# Altium schematic sheet 407-cpu .schdoc
size A4
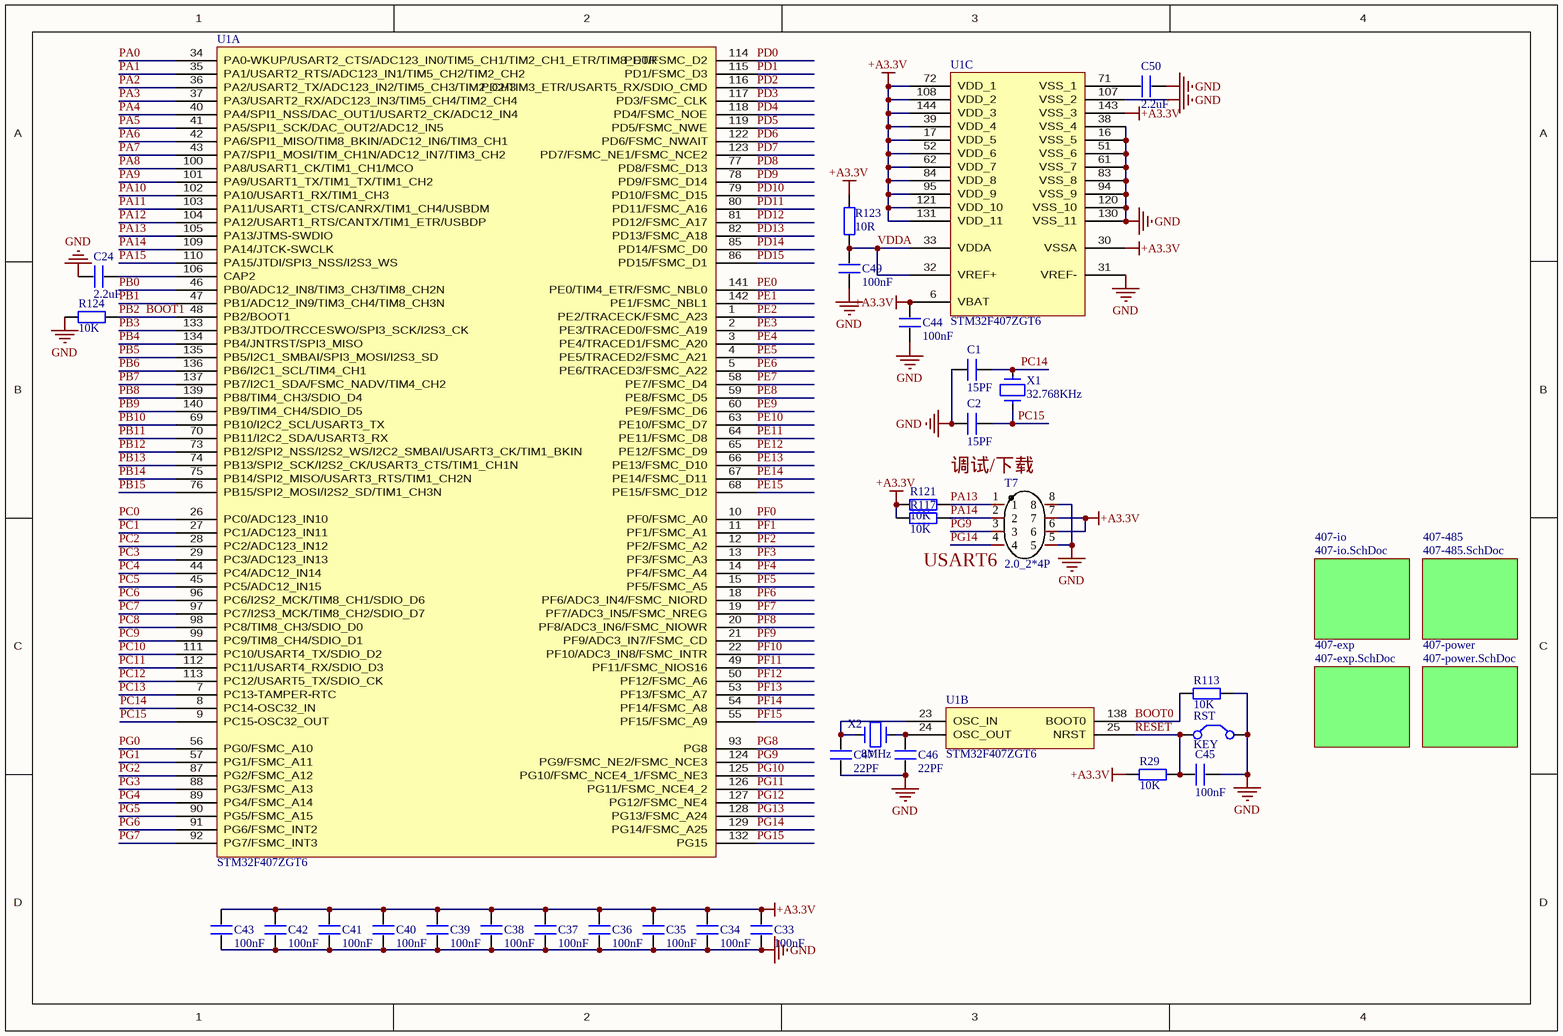
[diagram p0: 407-cpu .schdoc]

## Parts
C1  15PF
C2  15PF
C24  2.2uF
C33  100nF
C34  100nF
C35  100nF
C36  100nF
C37  100nF
C38  100nF
C39  100nF
C40  100nF
C41  100nF
C42  100nF
C43  100nF
C44  100nF
C45  100nF
C46  22PF
C47  22PF
C49  100nF
C50  2.2uF
R29  10K
R113  10K
R117  10K
R121  10K
R123  10R
R124  10K
RST  KEY
T7  2.0_2*4P  [2.0_2*4P]
U1  STM32F407ZGT6  (parts A,B,C of 3)
X1  32.768KHz
X2  8MHz

## Sub-sheets
407-485 = 407-485.SchDoc: no entries
407-exp = 407-exp.SchDoc: no entries
407-io = 407-io.SchDoc: no entries
407-power = 407-power.SchDoc: no entries

## Nets
+A3.3V: C33.2 C34.2 C35.2 C36.2 C37.2 C38.2 C39.2 C40.2 C41.2 C42.2 C43.2 C44.2 R29.1 R117.2 R121.2 R123.1 T7.6 T7.7 U1.6(VBAT) U1.17(VDD_5) U1.30(VSSA) U1.39(VDD_4) U1.52(VDD_6) U1.62(VDD_7) U1.72(VDD_1) U1.84(VDD_8) U1.95(VDD_9) U1.108(VDD_2) U1.121(VDD_10) U1.131(VDD_11) U1.143(VSS_3) U1.144(VDD_3)
GND: C1.2 C2.2 C24.1 C33.1 C34.1 C35.1 C36.1 C37.1 C38.1 C39.1 C40.1 C41.1 C42.1 C43.1 C44.1 C45.1 C46.1 C47.1 C49.1 C50.2 R113.2 R124.1 RST.2(C2) T7.5 T7.8 U1.16(VSS_5) U1.31(VREF-) U1.38(VSS_4) U1.51(VSS_6) U1.61(VSS_7) U1.83(VSS_8) U1.94(VSS_9) U1.107(VSS_2) U1.120(VSS_10) U1.130(VSS_11)
BOOT0: R113.1 U1.138(BOOT0)
BOOT1: R124.2 U1.48(PB2/BOOT1)  [also labelled PB2]
PA0: U1.34(PA0-WKUP/USART2_CTS/ADC123_IN0/TIM5_CH1/TIM2_CH1_ETR/TIM8_ETR)
PA1: U1.35(PA1/USART2_RTS/ADC123_IN1/TIM5_CH2/TIM2_CH2)
PA2: U1.36(PA2/USART2_TX/ADC123_IN2/TIM5_CH3/TIM2_CH3)
PA3: U1.37(PA3/USART2_RX/ADC123_IN3/TIM5_CH4/TIM2_CH4)
PA4: U1.40(PA4/SPI1_NSS/DAC_OUT1/USART2_CK/ADC12_IN4)
PA5: U1.41(PA5/SPI1_SCK/DAC_OUT2/ADC12_IN5)
PA6: U1.42(PA6/SPI1_MISO/TIM8_BKIN/ADC12_IN6/TIM3_CH1)
PA7: U1.43(PA7/SPI1_MOSI/TIM_CH1N/ADC12_IN7/TIM3_CH2)
PA8: U1.100(PA8/USART1_CK/TIM1_CH1/MCO)
PA9: U1.101(PA9/USART1_TX/TIM1_TX/TIM1_CH2)
PA10: U1.102(PA10/USART1_RX/TIM1_CH3)
PA11: U1.103(PA11/USART1_CTS/CANRX/TIM1_CH4/USBDM)
PA12: U1.104(PA12/USART1_RTS/CANTX/TIM1_ETR/USBDP)
PA13: R121.1 T7.1 U1.105(PA13/JTMS-SWDIO)
PA14: R117.1 T7.2 U1.109(PA14/JTCK-SWCLK)
PA15: U1.110(PA15/JTDI/SPI3_NSS/I2S3_WS)
PB0: U1.46(PB0/ADC12_IN8/TIM3_CH3/TIM8_CH2N)
PB1: U1.47(PB1/ADC12_IN9/TIM3_CH4/TIM8_CH3N)
PB3: U1.133(PB3/JTDO/TRCCESWO/SPI3_SCK/I2S3_CK)
PB4: U1.134(PB4/JNTRST/SPI3_MISO)
PB5: U1.135(PB5/I2C1_SMBAI/SPI3_MOSI/I2S3_SD)
PB6: U1.136(PB6/I2C1_SCL/TIM4_CH1)
PB7: U1.137(PB7/I2C1_SDA/FSMC_NADV/TIM4_CH2)
PB8: U1.139(PB8/TIM4_CH3/SDIO_D4)
PB9: U1.140(PB9/TIM4_CH4/SDIO_D5)
PB10: U1.69(PB10/I2C2_SCL/USART3_TX)
PB11: U1.70(PB11/I2C2_SDA/USART3_RX)
PB12: U1.73(PB12/SPI2_NSS/I2S2_WS/I2C2_SMBAI/USART3_CK/TIM1_BKIN)
PB13: U1.74(PB13/SPI2_SCK/I2S2_CK/USART3_CTS/TIM1_CH1N)
PB14: U1.75(PB14/SPI2_MISO/USART3_RTS/TIM1_CH2N)
PB15: U1.76(PB15/SPI2_MOSI/I2S2_SD/TIM1_CH3N)
PC0: U1.26(PC0/ADC123_IN10)
PC1: U1.27(PC1/ADC123_IN11)
PC2: U1.28(PC2/ADC123_IN12)
PC3: U1.29(PC3/ADC123_IN13)
PC4: U1.44(PC4/ADC12_IN14)
PC5: U1.45(PC5/ADC12_IN15)
PC6: U1.96(PC6/I2S2_MCK/TIM8_CH1/SDIO_D6)
PC7: U1.97(PC7/I2S3_MCK/TIM8_CH2/SDIO_D7)
PC8: U1.98(PC8/TIM8_CH3/SDIO_D0)
PC9: U1.99(PC9/TIM8_CH4/SDIO_D1)
PC10: U1.111(PC10/USART4_TX/SDIO_D2)
PC11: U1.112(PC11/USART4_RX/SDIO_D3)
PC12: U1.113(PC12/USART5_TX/SDIO_CK)
PC13: U1.7(PC13-TAMPER-RTC)
PC14: C1.1 U1.8(PC14-OSC32_IN) X1.1
PC15: C2.1 U1.9(PC15-OSC32_OUT) X1.2
PD0: U1.114(PD0/FSMC_D2)
PD1: U1.115(PD1/FSMC_D3)
PD2: U1.116(PD2/TIM3_ETR/USART5_RX/SDIO_CMD)
PD3: U1.117(PD3/FSMC_CLK)
PD4: U1.118(PD4/FSMC_NOE)
PD5: U1.119(PD5/FSMC_NWE)
PD6: U1.122(PD6/FSMC_NWAIT)
PD7: U1.123(PD7/FSMC_NE1/FSMC_NCE2)
PD8: U1.77(PD8/FSMC_D13)
PD9: U1.78(PD9/FSMC_D14)
PD10: U1.79(PD10/FSMC_D15)
PD11: U1.80(PD11/FSMC_A16)
PD12: U1.81(PD12/FSMC_A17)
PD13: U1.82(PD13/FSMC_A18)
PD14: U1.85(PD14/FSMC_D0)
PD15: U1.86(PD15/FSMC_D1)
PE0: U1.141(PE0/TIM4_ETR/FSMC_NBL0)
PE1: U1.142(PE1/FSMC_NBL1)
PE2: U1.1(PE2/TRACECK/FSMC_A23)
PE3: U1.2(PE3/TRACED0/FSMC_A19)
PE4: U1.3(PE4/TRACED1/FSMC_A20)
PE5: U1.4(PE5/TRACED2/FSMC_A21)
PE6: U1.5(PE6/TRACED3/FSMC_A22)
PE7: U1.58(PE7/FSMC_D4)
PE8: U1.59(PE8/FSMC_D5)
PE9: U1.60(PE9/FSMC_D6)
PE10: U1.63(PE10/FSMC_D7)
PE11: U1.64(PE11/FSMC_D8)
PE12: U1.65(PE12/FSMC_D9)
PE13: U1.66(PE13/FSMC_D10)
PE14: U1.67(PE14/FSMC_D11)
PE15: U1.68(PE15/FSMC_D12)
PF0: U1.10(PF0/FSMC_A0)
PF1: U1.11(PF1/FSMC_A1)
PF2: U1.12(PF2/FSMC_A2)
PF3: U1.13(PF3/FSMC_A3)
PF4: U1.14(PF4/FSMC_A4)
PF5: U1.15(PF5/FSMC_A5)
PF6: U1.18(PF6/ADC3_IN4/FSMC_NIORD)
PF7: U1.19(PF7/ADC3_IN5/FSMC_NREG)
PF8: U1.20(PF8/ADC3_IN6/FSMC_NIOWR)
PF9: U1.21(PF9/ADC3_IN7/FSMC_CD)
PF10: U1.22(PF10/ADC3_IN8/FSMC_INTR)
PF11: U1.49(PF11/FSMC_NIOS16)
PF12: U1.50(PF12/FSMC_A6)
PF13: U1.53(PF13/FSMC_A7)
PF14: U1.54(PF14/FSMC_A8)
PF15: U1.55(PF15/FSMC_A9)
PG0: U1.56(PG0/FSMC_A10)
PG1: U1.57(PG1/FSMC_A11)
PG2: U1.87(PG2/FSMC_A12)
PG3: U1.88(PG3/FSMC_A13)
PG4: U1.89(PG4/FSMC_A14)
PG5: U1.90(PG5/FSMC_A15)
PG6: U1.91(PG6/FSMC_INT2)
PG7: U1.92(PG7/FSMC_INT3)
PG8: U1.93(PG8)
PG9: T7.3 U1.124(PG9/FSMC_NE2/FSMC_NCE3)
PG10: U1.125(PG10/FSMC_NCE4_1/FSMC_NE3)
PG11: U1.126(PG11/FSMC_NCE4_2)
PG12: U1.127(PG12/FSMC_NE4)
PG13: U1.128(PG13/FSMC_A24)
PG14: T7.4 U1.129(PG14/FSMC_A25)
PG15: U1.132(PG15)
RESET: C45.2 R29.2 RST.1(C1) U1.25(NRST)
VDDA: C49.2 R123.2 U1.32(VREF+) U1.33(VDDA)
NetC24_2: C24.2 U1.106(CAP2)
NetC46_2: C46.2 U1.24(OSC_OUT) X2.2
NetC47_2: C47.2 U1.23(OSC_IN) X2.1
NetC50_1: C50.1 U1.71(VSS_1)

## Notes on the sheet
- 调试/下载
- USART6

## Library data of the parts
C1 C2 C24 C33-C47 C49 C50 = C
R29 R113 R117 R121 R123 R124 = Res2: Resistor
RST = Jumper: Jumper Wire; Published: 24-Mar-1999; LatestRevisionDate: 17-Jul-2002; LatestRevisionNote: Re-released for DXP Platform.; PackageReference: RAD-0.2; Publisher: Altium Limited
U1 = STM32F103ZET6_1
X1 X2 = XTAL: Crystal Oscillator